# Altium schematic sheet digital_signal_8_out.SchDoc
size A4
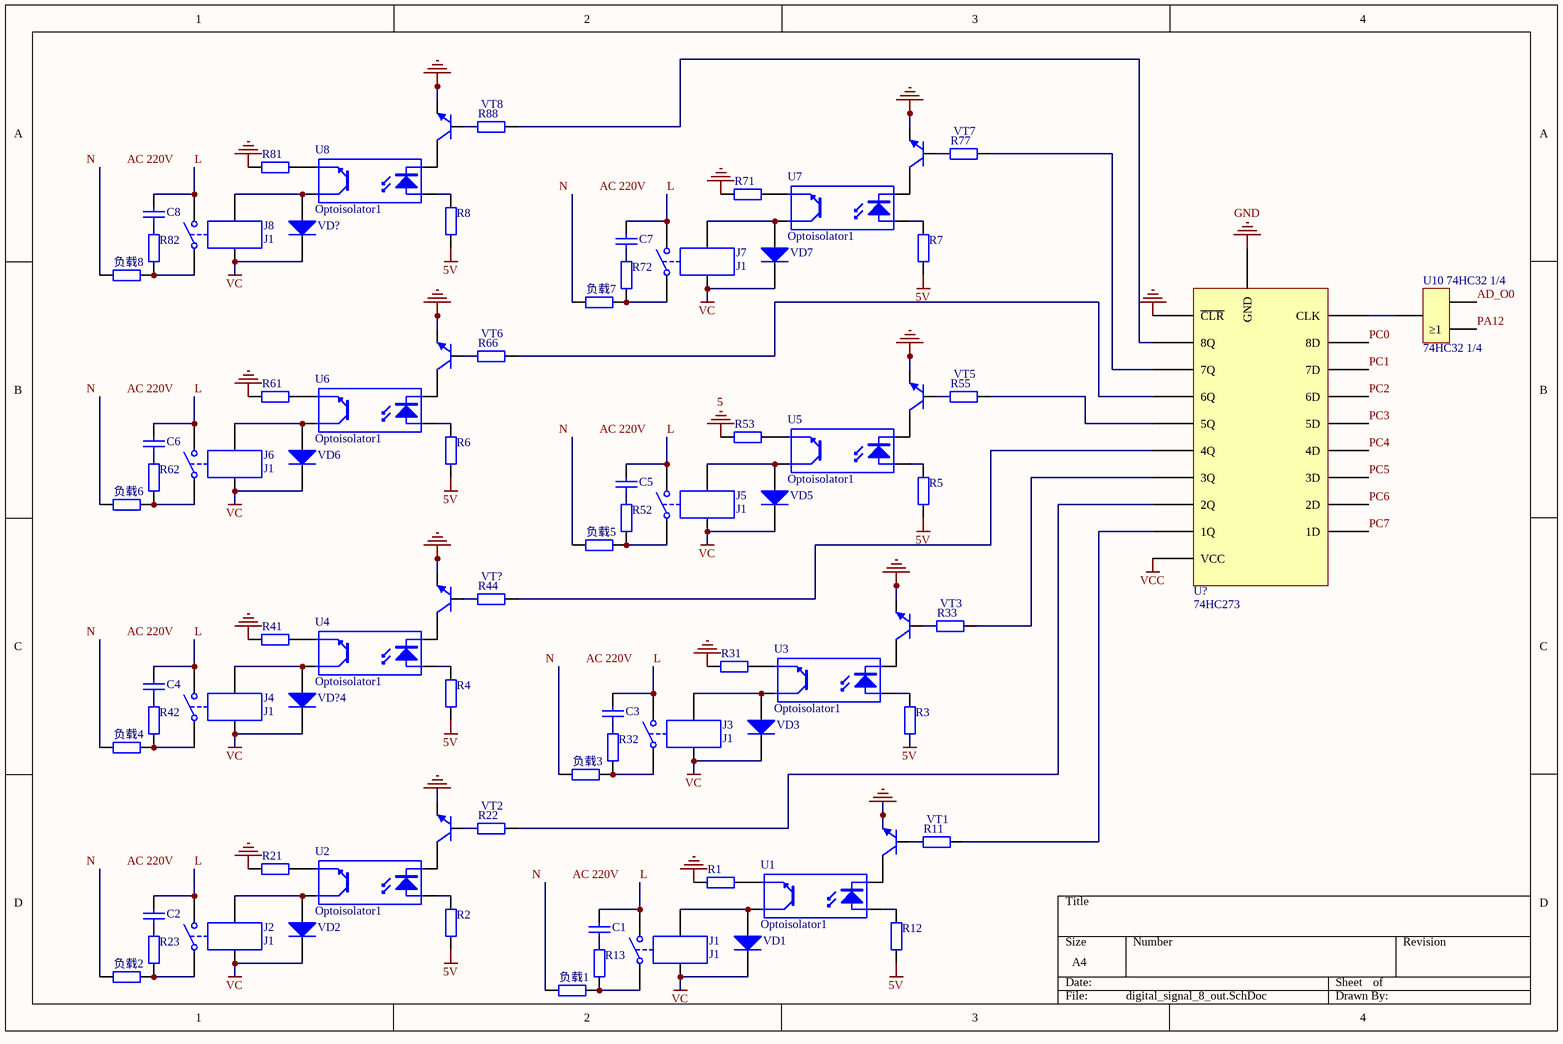
[diagram p0: digital_signal_8_out.SchDoc]

## Parts
C1  (no value)  [RAD-0.3]
C2  (no value)  [RAD-0.3]
C3  (no value)  [RAD-0.3]
C4  (no value)  [RAD-0.3]
C5  (no value)  [RAD-0.3]
C6  (no value)  [RAD-0.3]
C7  (no value)  [RAD-0.3]
C8  (no value)  [RAD-0.3]
J1  J1  [MODULE4]
J2  J1  [MODULE4]
J3  J1  [MODULE4]
J4  J1  [MODULE4]
J5  J1  [MODULE4]
J6  J1  [MODULE4]
J7  J1  [MODULE4]
J8  J1  [MODULE4]
R1  (no value)  [AXIAL-0.4]
R2  (no value)  [AXIAL-0.4]
R3  (no value)  [AXIAL-0.4]
R4  (no value)  [AXIAL-0.4]
R5  (no value)  [AXIAL-0.4]
R6  (no value)  [AXIAL-0.4]
R7  (no value)  [AXIAL-0.4]
R8  (no value)  [AXIAL-0.4]
R11  (no value)  [AXIAL-0.4]
R12  (no value)  [AXIAL-0.4]
R13  (no value)  [AXIAL-0.4]
R21  (no value)  [AXIAL-0.4]
R22  (no value)  [AXIAL-0.4]
R23  (no value)  [AXIAL-0.4]
R31  (no value)  [AXIAL-0.4]
R32  (no value)  [AXIAL-0.4]
R33  (no value)  [AXIAL-0.4]
R41  (no value)  [AXIAL-0.4]
R42  (no value)  [AXIAL-0.4]
R44  (no value)  [AXIAL-0.4]
R52  (no value)  [AXIAL-0.4]
R53  (no value)  [AXIAL-0.4]
R55  (no value)  [AXIAL-0.4]
R61  (no value)  [AXIAL-0.4]
R62  (no value)  [AXIAL-0.4]
R66  (no value)  [AXIAL-0.4]
R71  (no value)  [AXIAL-0.4]
R72  (no value)  [AXIAL-0.4]
R77  (no value)  [AXIAL-0.4]
R81  (no value)  [AXIAL-0.4]
R82  (no value)  [AXIAL-0.4]
R88  (no value)  [AXIAL-0.4]
U1  Optoisolator1  [DIP-4]
U2  Optoisolator1  [DIP-4]
U3  Optoisolator1  [DIP-4]
U4  Optoisolator1  [DIP-4]
U5  Optoisolator1  [DIP-4]
U6  Optoisolator1  [DIP-4]
U7  Optoisolator1  [DIP-4]
U8  Optoisolator1  [DIP-4]
U10_74HC32_1/4  74HC32 1/4
U?  74HC273
VD1  (no value)  [SMC]
VD2  (no value)  [SMC]
VD3  (no value)  [SMC]
VD5  (no value)  [SMC]
VD6  (no value)  [SMC]
VD7  (no value)  [SMC]
VD?  (no value)  [SMC]
VD?4  (no value)  [SMC]
VT1  (no value)  [TO-92A]
VT2  (no value)  [TO-92A]
VT3  (no value)  [TO-92A]
VT5  (no value)  [TO-92A]
VT6  (no value)  [TO-92A]
VT7  (no value)  [TO-92A]
VT8  (no value)  [TO-92A]
VT?  (no value)  [TO-92A]
负载1  (no value)  [AXIAL-0.4]
负载2  (no value)  [AXIAL-0.4]
负载3  (no value)  [AXIAL-0.4]
负载4  (no value)  [AXIAL-0.4]
负载5  (no value)  [AXIAL-0.4]
负载6  (no value)  [AXIAL-0.4]
负载7  (no value)  [AXIAL-0.4]
负载8  (no value)  [AXIAL-0.4]

## Nets
5: R53.1
5V: R2.2 R3.2 R4.2 R5.2 R6.2 R7.2 R8.2 R12.2
GND: U?.?20(GND)
NetR1_1: R1.1 R21.1 R31.1 R41.1 R61.1 R71.1 R81.1 U?.?10(~{CLR}) VT1.1(E) VT2.1(E) VT3.1(E) VT5.1(E) VT6.1(E) VT7.1(E) VT8.1(E) VT?.1(E)
VC: J1.3 J2.3 J3.3 J4.3 J5.3 J6.3 J7.3 J8.3 VD1.2(K) VD2.2(K) VD3.2(K) VD5.2(K) VD6.2(K) VD7.2(K) VD?.2(K) VD?4.2(K)
VCC: U?.?1(VCC)
AD_O0: U10_74HC32_1/4.?3
L: C1.1 C2.1 C3.1 C4.1 C5.1 C6.1 C7.1 C8.1 J1.2 J2.2 J3.2 J4.2 J5.2 J6.2 J7.2 J8.2
PA12: U10_74HC32_1/4.?2(≥1)
PC0: U?.?18(8D)
PC1: U?.?17(7D)
PC2: U?.?16(6D)
PC3: U?.?15(5D)
PC4: U?.?14(4D)
PC5: U?.?13(3D)
PC6: U?.?12(2D)
PC7: U?.?11(1D)
NetC1_2: C1.2 R13.1
NetC2_2: C2.2 R23.1
NetC3_2: C3.2 R32.1
NetC4_2: C4.2 R42.1
NetC5_2: C5.2 R52.1
NetC6_2: C6.2 R62.1
NetC7_2: C7.2 R72.1
NetC8_2: C8.2 R82.1
NetJ1_1: J1.1 R13.2 负载1.1
NetJ1_4: J1.4 U1.4(C) VD1.1(A)
NetJ2_1: J2.1 R23.2 负载2.1
NetJ2_4: J2.4 U2.4(C) VD2.1(A)
NetJ3_1: J3.1 R32.2 负载3.1
NetJ3_4: J3.4 U3.4(C) VD3.1(A)
NetJ4_1: J4.1 R42.2 负载4.1
NetJ4_4: J4.4 U4.4(C) VD?4.1(A)
NetJ5_1: J5.1 R52.2 负载5.1
NetJ5_4: J5.4 U5.4(C) VD5.1(A)
NetJ6_1: J6.1 R62.2 负载6.1
NetJ6_4: J6.4 U6.4(C) VD6.1(A)
NetJ7_1: J7.1 R72.2 负载7.1
NetJ7_4: J7.4 U7.4(C) VD7.1(A)
NetJ8_1: J8.1 R82.2 负载8.1
NetJ8_4: J8.4 U8.4(C) VD?.1(A)
NetR1_2: R1.2 U1.3(E)
NetR2_1: R2.1 U2.1(A)
NetR3_1: R3.1 U3.1(A)
NetR4_1: R4.1 U4.1(A)
NetR5_1: R5.1 U5.1(A)
NetR6_1: R6.1 U6.1(A)
NetR7_1: R7.1 U7.1(A)
NetR8_1: R8.1 U8.1(A)
NetR11_1: R11.1 U?.?2(1Q)
NetR11_2: R11.2 VT1.2(B)
NetR12_1: R12.1 U1.1(A)
NetR21_2: R21.2 U2.3(E)
NetR22_1: R22.1 U?.?3(2Q)
NetR22_2: R22.2 VT2.2(B)
NetR31_2: R31.2 U3.3(E)
NetR33_1: R33.1 U?.?4(3Q)
NetR33_2: R33.2 VT3.2(B)
NetR41_2: R41.2 U4.3(E)
NetR44_1: R44.1 U?.?5(4Q)
NetR44_2: R44.2 VT?.2(B)
NetR53_2: R53.2 U5.3(E)
NetR55_1: R55.1 U?.?7(5Q)
NetR55_2: R55.2 VT5.2(B)
NetR61_2: R61.2 U6.3(E)
NetR66_1: R66.1 U?.?6(6Q)
NetR66_2: R66.2 VT6.2(B)
NetR71_2: R71.2 U7.3(E)
NetR77_1: R77.1 U?.?8(7Q)
NetR77_2: R77.2 VT7.2(B)
NetR81_2: R81.2 U8.3(E)
NetR88_1: R88.1 U?.?9(8Q)
NetR88_2: R88.2 VT8.2(B)
NetU1_2: U1.2(K) VT1.3(C)
NetU2_2: U2.2(K) VT2.3(C)
NetU3_2: U3.2(K) VT3.3(C)
NetU4_2: U4.2(K) VT?.3(C)
NetU5_2: U5.2(K) VT5.3(C)
NetU6_2: U6.2(K) VT6.3(C)
NetU7_2: U7.2(K) VT7.3(C)
NetU8_2: U8.2(K) VT8.3(C)
NetU10_74HC32_1/4_?1: U10_74HC32_1/4.?1 U?.?19(CLK)

Not connected (* = marked no-connect by the designer): 负载1 2; 负载2 2; 负载3 2; 负载4 2; 负载5 2; 负载6 2; 负载7 2; 负载8 2

## Notes on the sheet
- Labels drawn without touching a wire or pin: AC 220V, N

## Library data of the parts
C1-C8 = Cap: Capacitor; Published: 8-Jun-2000; LatestRevisionDate: 17-Jul-2002; LatestRevisionNote: Re-released for DXP Platform.; PackageReference: RAD-0.3; Publisher: Altium Limited; PackageDescription: Radial Cap, Thru-Hole; 2 Leads; 0.3 in Pin Spacing
J1-J8 = Relay-SPST: Single-Pole Single-Throw Relay; Published: 24-Mar-1999; LatestRevisionDate: 17-Jul-2002; LatestRevisionNote: Re-released for DXP Platform.; PackageReference: MODULE4; Publisher: Altium Limited
R1-R8 R11-R13 R21-R23 R31-R33 R41 R42 R44 R52 R53 R55 R61 R62 R66 R71 R72 R77 R81 R82 R88 负载1-负载8 = Res2: Resistor; Published: 8-Jun-2000; LatestRevisionDate: 17-Jul-2002; LatestRevisionNote: Re-released for DXP Platform.; PackageReference: AXIAL-0.4; Publisher: Altium Limited; PackageDescription: Axial Device, Thru-Hole; 2 Leads; 0.4 in Pin Spacing
U1-U8 = Optoisolator1: 4-Pin Phototransistor Optocoupler; Published: 24-Mar-1999; LatestRevisionDate: 04-Mar-2005; LatestRevisionNote: Sch pins 3 & 4 Swapped.; DatasheetVersion: Nov-2003; PackageReference: DIP-4; Publisher: Altium Limited
VD1-VD3 VD5-VD7 VD? VD?4 = Diode: Default Diode; Published: 8-Jun-2000; LatestRevisionDate: 17-Jul-2002; LatestRevisionNote: Re-released for DXP Platform.; PackageVersion: Sep-1996; PackageReference: SMC; Publisher: Altium Limited; PackageDescription: DO-214-AB/SMC; 2 C-Bend Leads; Body 7.9 x 5.9 mm, inc. leads (LxW); Code_JEDEC: DO-214-AB
VT1-VT3 VT5-VT8 VT? = 2N3904: NPN General Purpose Amplifier; Published: 8-Jun-2000; LatestRevisionDate: 15-Jan-2003; LatestRevisionNote: PCB Footprint 'BCY-W3/D4.7' replaced; DatasheetVersion: 1997; PackageVersion: Sep-1998; PackageReference: TO-92A; Publisher: Altium Limited; PackageDescription: TO, Flat Index; 3 In-Line, Axial Leads; Body Dia. 4.5mm; Leads 0.51 x 0.48 mm (max); ComponentLink1Description: Manufacturer Link; ComponentLink1URL: http://www.fairchildsemi.com/; ComponentLink2Description: Datasheet; ComponentLink2URL: http://www.fairchildsemi.com/ds/2N%2F2N3904.pdf